# EAGLE board Noctua 2 (EAGLE 9.5.1), part 1 of 2
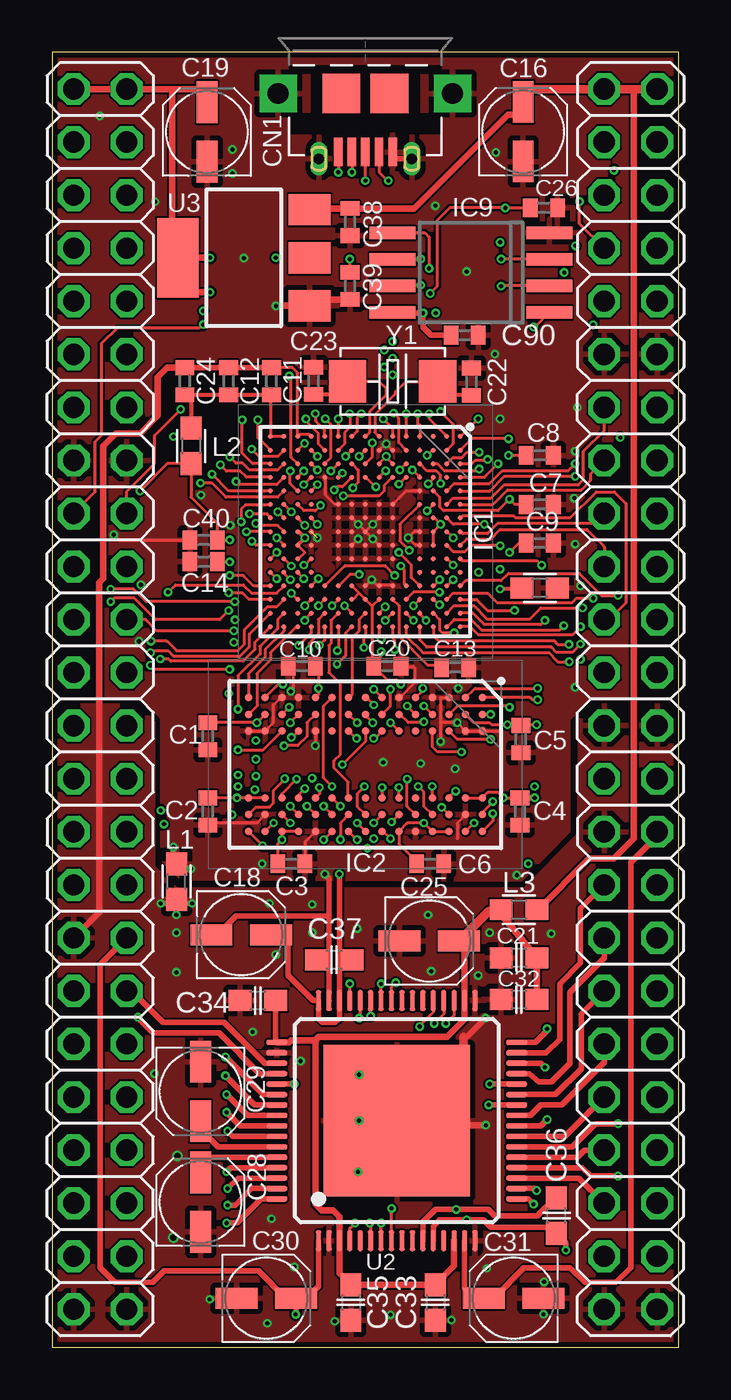
[diagram p2: board, top side]
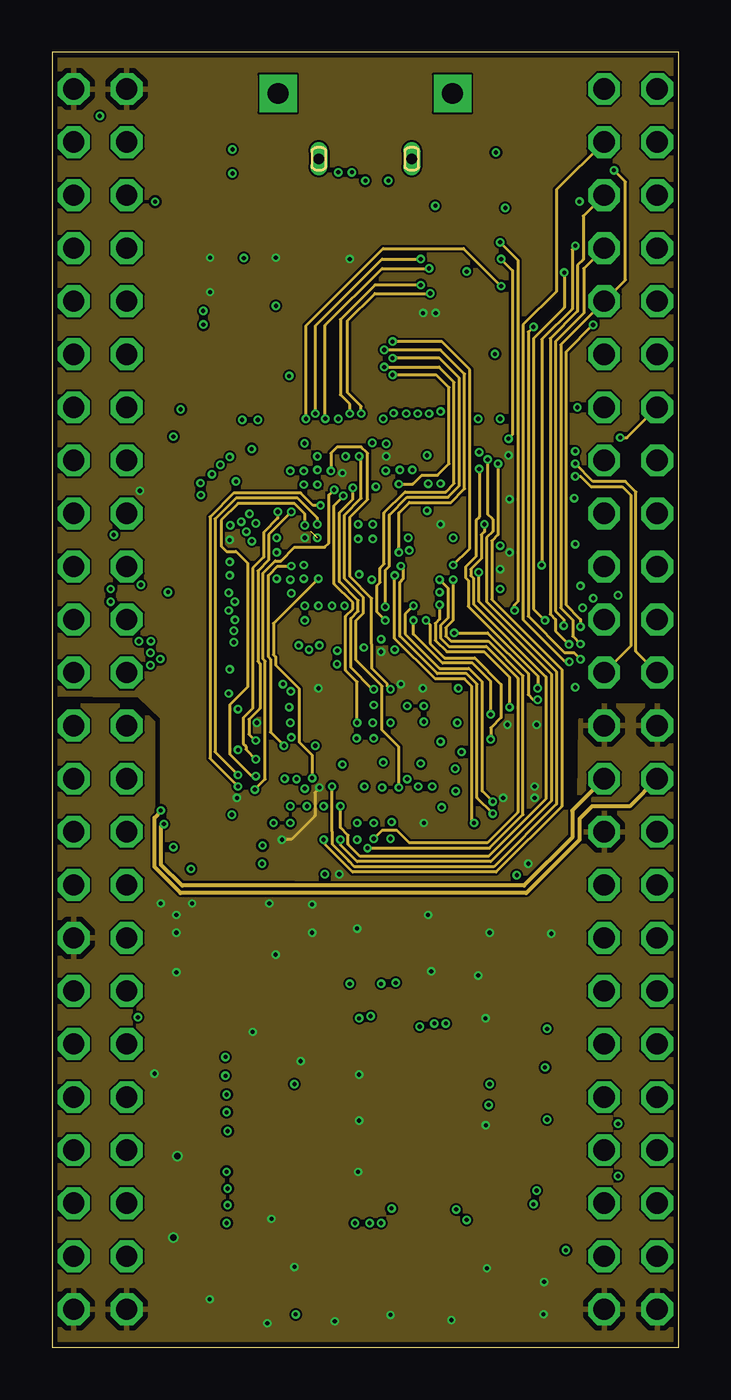
[diagram p3: board, inner layer InnerTop]
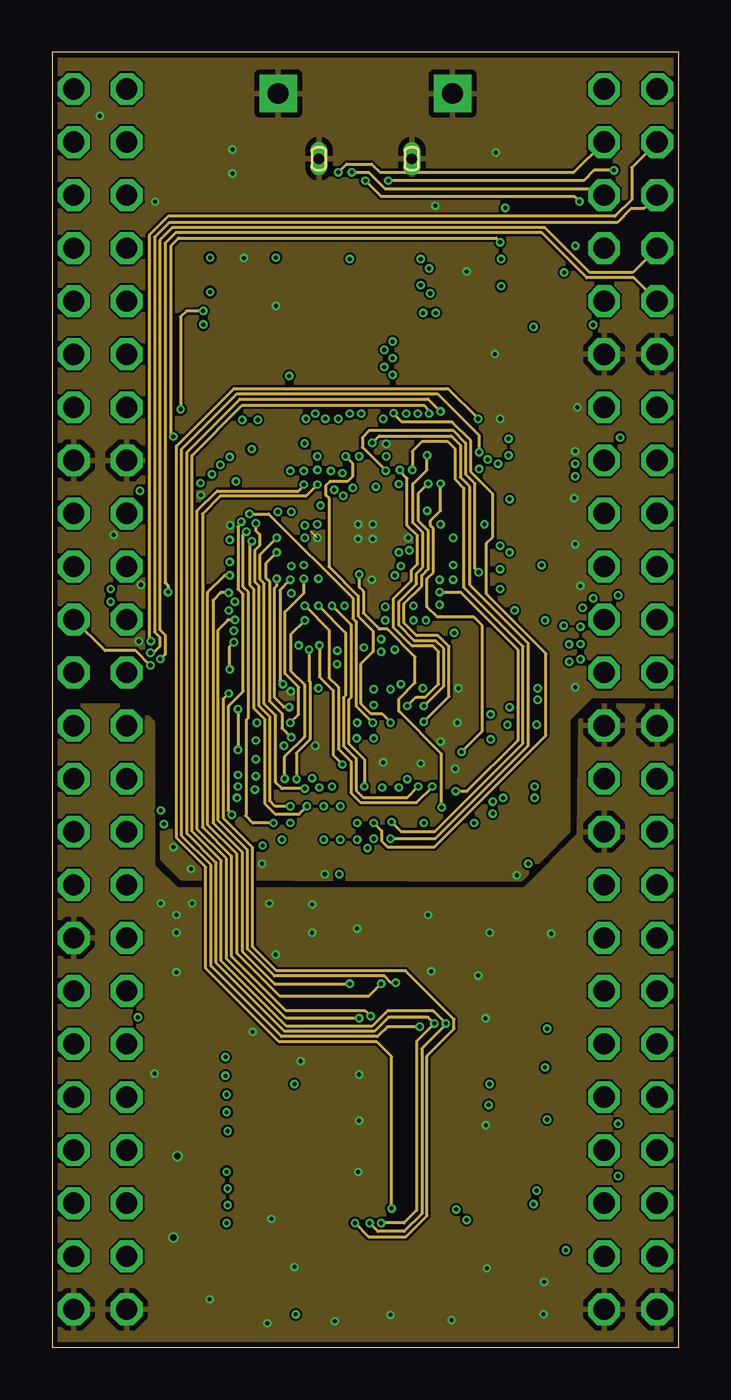
[diagram p4: board, inner layer InnerBottom]
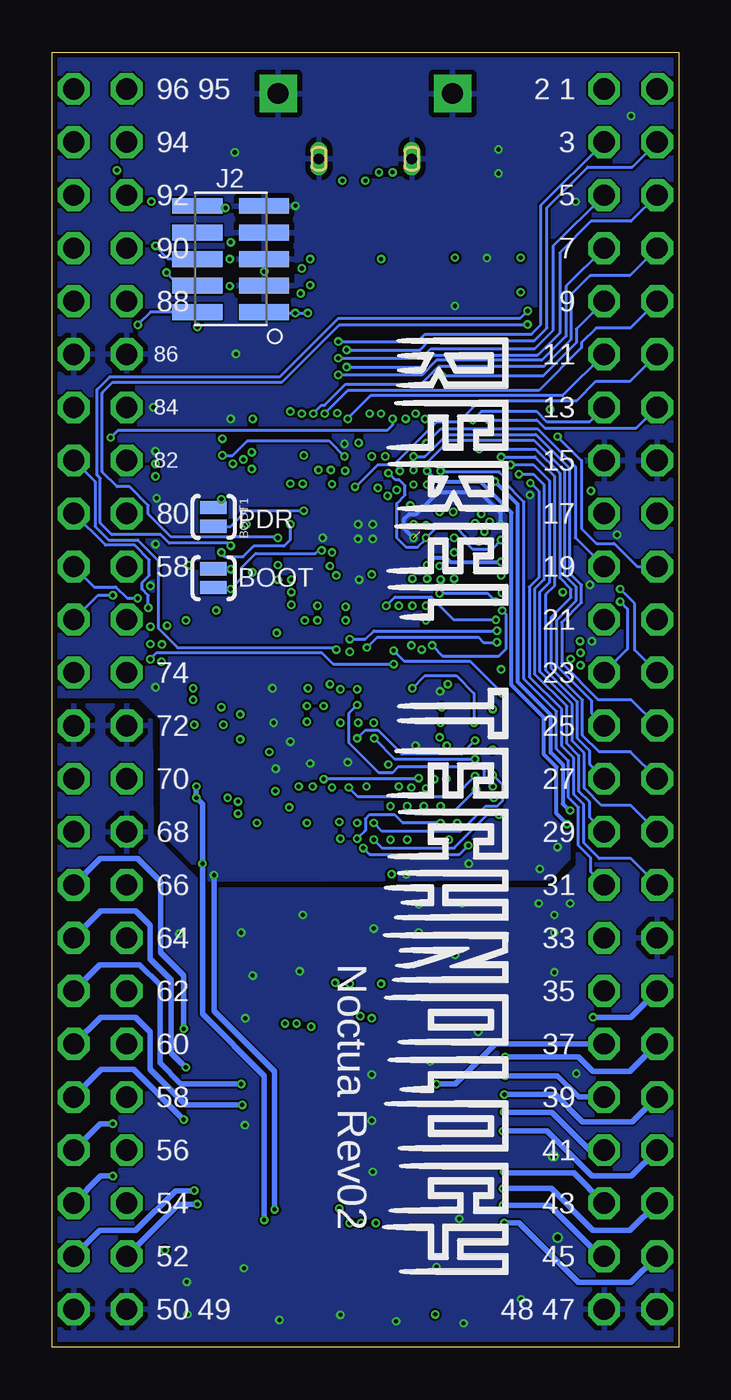
[diagram p5: board, bottom side, seen from below]

Size 30 x 62 mm. Coordinates in mm from the lower left corner, seen from the top.
Outline: 0,0 30,0 30,62 0,62 0,0
Copper layers (1*2*15*16): Top 0.035mm / dielectric 0.2mm / InnerTop 0.0175mm / dielectric 0.3mm / InnerBottom 0.0175mm / dielectric 0.2mm / Bottom 0.035mm
Design rules "PCBWay_4layer_20210129": minimum track width 0.1mm, minimum drill 0.2mm, track to track 0.1mm, track to pad 0.1mm, pad to pad 0.1mm, via to via 0.1mm, smd to smd 0mil, copper to edge 10mil, drill to drill 8mil, minimum pad ring 6mil, minimum via ring 4mil, stop-mask expansion 4mil, vias tented up to drill 25mil, thermal gap 10mil
Net classes: 1 power: width 0.178 mm, drill 0.305 mm, clearance 0.178 mm to class 0, clearance 0.178 mm

## Footprints (pad centres in the part's own frame; a part is rotated, then mirrored left to right if it is on the bottom)
SJ_2S-NO = smd 0.635 x 1.27: 1 -0.45,0; 2 0.45,0
C0402 = smd 0.7 x 0.9: 1 -0.65,0; 2 0.65,0
UD-4X5,8_NICHICON = smd 2 x 1: + 1.425,0; - -1.425,0
C0603 = smd 1.1 x 1: 1 -0.85,0; 2 0.85,0
HRS_ZX62RD-AB-5P8 = smd 0.4 x 1.35: 1 1.3,2.275; 2 0.65,2.275; 3 0,2.275; 4 -0.65,2.275; 5 -1.3,2.275 | smd 1.8 x 1.9: D_0 -1.15,-0.525; D_1 1.15,-0.525 | drill 1 pad 1.8 square: G -4.175,-0.525; G2 4.175,-0.525 | drill 0.5 long: G3 -2.225,2.6; G4 2.225,2.6
BGA201C65P15X15_1000X1000X60 = smd 0.232 x 0.232: A1 -4.55,4.55; A2 -3.9,4.55; A3 -3.25,4.55; A4 -2.6,4.55; A5 -1.95,4.55; A6 -1.3,4.55; A7 -0.65,4.55; A8 0,4.55; A9 0.65,4.55; A10 1.3,4.55; A11 1.95,4.55; A12 2.6,4.55; A13 3.25,4.55; A14 3.9,4.55; A15 4.55,4.55; B1 -4.55,3.9; B2 -3.9,3.9; B3 -3.25,3.9; B4 -2.6,3.9; B5 -1.95,3.9; B6 -1.3,3.9; B7 -0.65,3.9; B8 0,3.9; B9 0.65,3.9; B10 1.3,3.9; B11 1.95,3.9; B12 2.6,3.9; B13 3.25,3.9; B14 3.9,3.9; B15 4.55,3.9; C1 -4.55,3.25; C2 -3.9,3.25; C3 -3.25,3.25; C4 -2.6,3.25; C5 -1.95,3.25; C6 -1.3,3.25; C7 -0.65,3.25; C8 0,3.25; C9 0.65,3.25; C10 1.3,3.25; C11 1.95,3.25; C12 2.6,3.25; C13 3.25,3.25; C14 3.9,3.25; C15 4.55,3.25; D1 -4.55,2.6; D2 -3.9,2.6; D3 -3.25,2.6; D4 -2.6,2.6; D5 -1.95,2.6; D6 -1.3,2.6; D7 -0.65,2.6; D8 0,2.6; D9 0.65,2.6; D10 1.3,2.6; D11 1.95,2.6; D12 2.6,2.6; D13 3.25,2.6; D14 3.9,2.6; D15 4.55,2.6; E1 -4.55,1.95; E2 -3.9,1.95; E3 -3.25,1.95; E4 -2.6,1.95; E12 2.6,1.95; E13 3.25,1.95; E14 3.9,1.95; E15 4.55,1.95; F1 -4.55,1.3; F2 -3.9,1.3; F3 -3.25,1.3; F4 -2.6,1.3; F6 -1.3,1.3; F7 -0.65,1.3; F8 0,1.3; F9 0.65,1.3; F10 1.3,1.3; F12 2.6,1.3; F13 3.25,1.3; F14 3.9,1.3; F15 4.55,1.3; G1 -4.55,0.65; G2 -3.9,0.65; G3 -3.25,0.65; G4 -2.6,0.65; G6 -1.3,0.65; G7 -0.65,0.65; G8 0,0.65; G9 0.65,0.65; G10 1.3,0.65; G12 2.6,0.65; G13 3.25,0.65; G14 3.9,0.65; G15 4.55,0.65; H1 -4.55,0; H2 -3.9,0; H3 -3.25,0; H4 -2.6,0; H6 -1.3,0; H7 -0.65,0; H8 0,0; H9 0.65,0; H10 1.3,0; H12 2.6,0; H13 3.25,0; H14 3.9,0; H15 4.55,0; J1 -4.55,-0.65; J2 -3.9,-0.65; J3 -3.25,-0.65; J4 -2.6,-0.65; J6 -1.3,-0.65; J7 -0.65,-0.65; J8 0,-0.65; J9 0.65,-0.65; J10 1.3,-0.65; J12 2.6,-0.65; J13 3.25,-0.65; J14 3.9,-0.65; J15 4.55,-0.65; K1 -4.55,-1.3; K2 -3.9,-1.3; K3 -3.25,-1.3; K4 -2.6,-1.3; K6 -1.3,-1.3; K7 -0.65,-1.3; K8 0,-1.3; K9 0.65,-1.3; K10 1.3,-1.3; K12 2.6,-1.3; K13 3.25,-1.3; K14 3.9,-1.3; K15 4.55,-1.3; L1 -4.55,-1.95; L2 -3.9,-1.95; L3 -3.25,-1.95; L4 -2.6,-1.95; L12 2.6,-1.95; L13 3.25,-1.95; L14 3.9,-1.95; L15 4.55,-1.95; M1 -4.55,-2.6; M2 -3.9,-2.6; M3 -3.25,-2.6; M4 -2.6,-2.6; M5 -1.95,-2.6; M6 -1.3,-2.6; M7 -0.65,-2.6; M8 0,-2.6; M9 0.65,-2.6; M10 1.3,-2.6; M11 1.95,-2.6; M12 2.6,-2.6; M13 3.25,-2.6; M14 3.9,-2.6; M15 4.55,-2.6; N1 -4.55,-3.25; N2 -3.9,-3.25; N3 -3.25,-3.25; N4 -2.6,-3.25; N5 -1.95,-3.25; N6 -1.3,-3.25; N7 -0.65,-3.25; N8 0,-3.25; N9 0.65,-3.25; N10 1.3,-3.25; N11 1.95,-3.25; N12 2.6,-3.25; N13 3.25,-3.25; N14 3.9,-3.25; N15 4.55,-3.25; P1 -4.55,-3.9; P2 -3.9,-3.9; P3 -3.25,-3.9; P4 -2.6,-3.9; P5 -1.95,-3.9; P6 -1.3,-3.9; P7 -0.65,-3.9; P8 0,-3.9; P9 0.65,-3.9; P10 1.3,-3.9; P11 1.95,-3.9; P12 2.6,-3.9; P13 3.25,-3.9; P14 3.9,-3.9; P15 4.55,-3.9; R1 -4.55,-4.55; R2 -3.9,-4.55; R3 -3.25,-4.55; R4 -2.6,-4.55; R5 -1.95,-4.55; R6 -1.3,-4.55; R7 -0.65,-4.55; R8 0,-4.55; R9 0.65,-4.55; R10 1.3,-4.55; R11 1.95,-4.55; R12 2.6,-4.55; R13 3.25,-4.55; R14 3.9,-4.55; R15 4.55,-4.55
BGA90C80P9X15_800X1300X100 = smd 0.37 x 0.37: A1 -3.2,5.6; A2 -2.4,5.6; A3 -1.6,5.6; A7 1.6,5.6; A8 2.4,5.6; A9 3.2,5.6; B1 -3.2,4.8; B2 -2.4,4.8; B3 -1.6,4.8; B7 1.6,4.8; B8 2.4,4.8; B9 3.2,4.8; C1 -3.2,4; C2 -2.4,4; C3 -1.6,4; C7 1.6,4; C8 2.4,4; C9 3.2,4; D1 -3.2,3.2; D2 -2.4,3.2; D3 -1.6,3.2; D7 1.6,3.2; D8 2.4,3.2; D9 3.2,3.2; E1 -3.2,2.4; E2 -2.4,2.4; E3 -1.6,2.4; E7 1.6,2.4; E8 2.4,2.4; E9 3.2,2.4; F1 -3.2,1.6; F2 -2.4,1.6; F3 -1.6,1.6; F7 1.6,1.6; F8 2.4,1.6; F9 3.2,1.6; G1 -3.2,0.8; G2 -2.4,0.8; G3 -1.6,0.8; G7 1.6,0.8; G8 2.4,0.8; G9 3.2,0.8; H1 -3.2,0; H2 -2.4,0; H3 -1.6,0; H7 1.6,0; H8 2.4,0; H9 3.2,0; J1 -3.2,-0.8; J2 -2.4,-0.8; J3 -1.6,-0.8; J7 1.6,-0.8; J8 2.4,-0.8; J9 3.2,-0.8; K1 -3.2,-1.6; K2 -2.4,-1.6; K3 -1.6,-1.6; K7 1.6,-1.6; K8 2.4,-1.6; K9 3.2,-1.6; L1 -3.2,-2.4; L2 -2.4,-2.4; L3 -1.6,-2.4; L7 1.6,-2.4; L8 2.4,-2.4; L9 3.2,-2.4; M1 -3.2,-3.2; M2 -2.4,-3.2; M3 -1.6,-3.2; M7 1.6,-3.2; M8 2.4,-3.2; M9 3.2,-3.2; N1 -3.2,-4; N2 -2.4,-4; N3 -1.6,-4; N7 1.6,-4; N8 2.4,-4; N9 3.2,-4; P1 -3.2,-4.8; P2 -2.4,-4.8; P3 -1.6,-4.8; P7 1.6,-4.8; P8 2.4,-4.8; P9 3.2,-4.8; R1 -3.2,-5.6; R2 -2.4,-5.6; R3 -1.6,-5.6; R7 1.6,-5.6; R8 2.4,-5.6; R9 3.2,-5.6
SO8W = smd 0.6 x 2.2: 1 -1.905,-3.75; 2 -0.635,-3.75; 3 0.635,-3.75; 4 1.905,-3.75; 5 1.905,3.75; 6 0.635,3.75; 7 -0.635,3.75; 8 -1.905,3.75
2X5_1.27MM_SMD = smd 2.4 x 0.76: 1 -1.6,2.54; 2 1.6,2.54; 3 -1.6,1.27; 4 1.6,1.27; 5 -1.6,0; 6 1.6,0; 7 -1.6,-1.27; 8 1.6,-1.27; 9 -1.6,-2.54; 10 1.6,-2.54
2X24 = drill 1.016 octagon: 1 -27.94,-1.27; 2 -27.94,1.27; 3 -25.4,-1.27; 4 -25.4,1.27; 5 -22.86,-1.27; 6 -22.86,1.27; 7 -20.32,-1.27; 8 -20.32,1.27; 9 -17.78,-1.27; 10 -17.78,1.27; 11 -15.24,-1.27; 12 -15.24,1.27; 13 -12.7,-1.27; 14 -12.7,1.27; 15 -10.16,-1.27; 16 -10.16,1.27; 17 -7.62,-1.27; 18 -7.62,1.27; 19 -5.08,-1.27; 20 -5.08,1.27; 21 -2.54,-1.27; 22 -2.54,1.27; 23 0,-1.27; 24 0,1.27; 25 2.54,-1.27; 26 2.54,1.27; 27 5.08,-1.27; 28 5.08,1.27; 29 7.62,-1.27; 30 7.62,1.27; 31 10.16,-1.27; 32 10.16,1.27; 33 12.7,-1.27; 34 12.7,1.27; 35 15.24,-1.27; 36 15.24,1.27; 37 17.78,-1.27; 38 17.78,1.27; 39 20.32,-1.27; 40 20.32,1.27; 41 22.86,-1.27; 42 22.86,1.27; 43 25.4,-1.27; 44 25.4,1.27; 45 27.94,-1.27; 46 27.94,1.27; 47 30.48,-1.27; 48 30.48,1.27
0603 = smd 1.1 x 1: 1 -0.85,0; 2 0.85,0
PQFP64 = smd 0.25 x 1: 1 -3.75,-5.75; 2 -3.25,-5.75; 3 -2.75,-5.75; 4 -2.25,-5.75; 5 -1.75,-5.75; 6 -1.25,-5.75; 7 -0.75,-5.75; 8 -0.25,-5.75; 9 0.25,-5.75; 10 0.75,-5.75; 11 1.25,-5.75; 12 1.75,-5.75; 13 2.25,-5.75; 14 2.75,-5.75; 15 3.25,-5.75; 16 3.75,-5.75; 33 3.75,5.75; 34 3.25,5.75; 35 2.75,5.75; 36 2.25,5.75; 37 1.75,5.75; 38 1.25,5.75; 39 0.75,5.75; 40 0.25,5.75; 41 -0.25,5.75; 42 -0.75,5.75; 43 -1.25,5.75; 44 -1.75,5.75; 45 -2.25,5.75; 46 -2.75,5.75; 47 -3.25,5.75; 48 -3.75,5.75 | smd 1 x 0.25: 17 5.75,-3.75; 18 5.75,-3.25; 19 5.75,-2.75; 20 5.75,-2.25; 21 5.75,-1.75; 22 5.75,-1.25; 23 5.75,-0.75; 24 5.75,-0.25; 25 5.75,0.25; 26 5.75,0.75; 27 5.75,1.25; 28 5.75,1.75; 29 5.75,2.25; 30 5.75,2.75; 31 5.75,3.25; 32 5.75,3.75; 49 -5.75,3.75; 50 -5.75,3.25; 51 -5.75,2.75; 52 -5.75,2.25; 53 -5.75,1.75; 54 -5.75,1.25; 55 -5.75,0.75; 56 -5.75,0.25; 57 -5.75,-0.25; 58 -5.75,-0.75; 59 -5.75,-1.25; 60 -5.75,-1.75; 61 -5.75,-2.25; 62 -5.75,-2.75; 63 -5.75,-3.25; 64 -5.75,-3.75 | smd 7 x 7.26: EP 0,0
SOT223 = smd 1.5 x 2: 1 -2.3,-3.15; 2 0,-3.15; 3 2.3,-3.15 | smd 3.8 x 2: 4 0,3.15
X2-SMD-5.0X3.2X1.3MM = smd 1.778 x 2.032: 1 -2.159,0; 2 2.159,0

## Placement (x,y rotation side)
BOOT  SOLDERJUMPERNO  [SJ_2S-NO]  22.27,36.82 270 bottom
BOOT1  SOLDERJUMPERNO  [SJ_2S-NO]  22.27,39.75 270 bottom
C1  100n  [C0402]  7.45,29.25 270 top
C2  100n  [C0402]  7.45,25.65 270 top
C3  100n  [C0402]  11.45,23.15 0 top
C4  100n  [C0402]  22.4,25.65 270 top
C5  100n  [C0402]  22.44,29.11 270 top
C6  100n  [C0402]  18.1,23.15 0 top
C7  100n  [C0402]  23.35,40.35 0 top
C8  100n  [C0402]  23.35,42.7 0 top
C9  100n  [C0402]  23.35,38.5 0 top
C10  100n  [C0402]  11.95,32.6 180 top
C11  100n  [C0402]  10.5,46.25 90 top
C12  1u  [C0402]  8.45,46.25 90 top
C13  2u2  [C0402]  19.3,32.55 0 top
C14  2u2  [C0402]  7.25,37.61 180 top
C16  10u  [UD-4X5,8_NICHICON]  22.55,58.19 90 top
C18  10u  [UD-4X5,8_NICHICON]  9.05,19.75 0 top
C19  10u  [UD-4X5,8_NICHICON]  7.41,58.18 90 top
C20  100n  [C0402]  16.05,32.6 0 top
C21  100n  [C0603]  22.35,18.65 180 top
C22  22p  [C0402]  20.08,46.23 90 top
C23  22p  [C0402]  12.52,46.27 90 top
C24  100n  [C0402]  6.35,46.25 90 top
C25  10u  [UD-4X5,8_NICHICON]  18.05,19.45 0 top
C26  100n  [C0402]  23.55,54.55 0 top
C28  10u  [UD-4X5,8_NICHICON]  7.1,6.95 90 top
C29  10u  [UD-4X5,8_NICHICON]  7.1,12.25 270 top
C30  10u  [UD-4X5,8_NICHICON]  10.25,2.35 0 top
C31  10u  [UD-4X5,8_NICHICON]  22.1,2.35 180 top
C32  1u  [C0603]  22.35,16.65 180 top
C33  1u  [C0603]  18.35,2.15 270 top
C34  1u  [C0603]  9.85,16.6 180 top
C35  1u  [C0603]  14.3,2.15 270 top
C36  1u  [C0603]  24.15,6.3 90 top
C37  1u  [C0603]  13.5,18.55 180 top
C38  100n  [C0402]  14.26,53.87 90 top
C39  100n  [C0402]  14.26,50.82 270 top
C40  100n  [C0402]  7.25,38.65 180 top
C90  100n  [C0402]  19.75,48.45 0 top
CN1  [HRS_ZX62RD-AB-5P8]  15,59.5 180 top
IC1  STM32H743IIK6  [BGA201C65P15X15_1000X1000X60]  15,39.05 270 top
IC2  AS4C16M32MSA-6BIN  [BGA90C80P9X15_800X1300X100]  15,27.9 270 top
IC9  S25FL064LABMFI010  [SO8W]  20.05,51.45 90 top
J2  FTS-105-01-F-DV  [2X5_1.27MM_SMD]  21.45,52.1 180 bottom
JP1  [2X24]  2.3,32.3 270 top
JP2  [2X24]  27.7,32.3 270 top
L1  Ferrite Bead  [0603]  5.95,22.3 90 top
L2  Ferrite Bead  [0603]  6.65,43.15 270 top
L3  Ferrite Bead  [0603]  22.35,20.95 0 top
R1  22R  [0603]  23.35,36.35 180 top
U2  PCM3168A  [PQFP64]  16.5,10.85 0 top
U3  TLV1117LV33DCYR  [SOT223]  9.17,52.16 90 top
Y1  8MHz  [X2-SMD-5.0X3.2X1.3MM]  16.3,46.24 0 top